# EAGLE design 50Ohm (EAGLE 9.6.2)
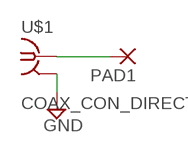
[diagram p0: schematic, sheet 1]

## Parts
PAD1  SMD5  [SMD2,54-5,08]
U$1  COAX_CON_DIRECT  [COAX.141]

## Nets
GND: U$1.P$2(GND)
N$1: PAD1.1(P) U$1.P$1

## Library data of the parts
PAD1 = wirepad:SMD5: SMD PAD
U$1 = Orzada:COAX_CON_DIRECT: Direct Coax to Bord Top

## Board
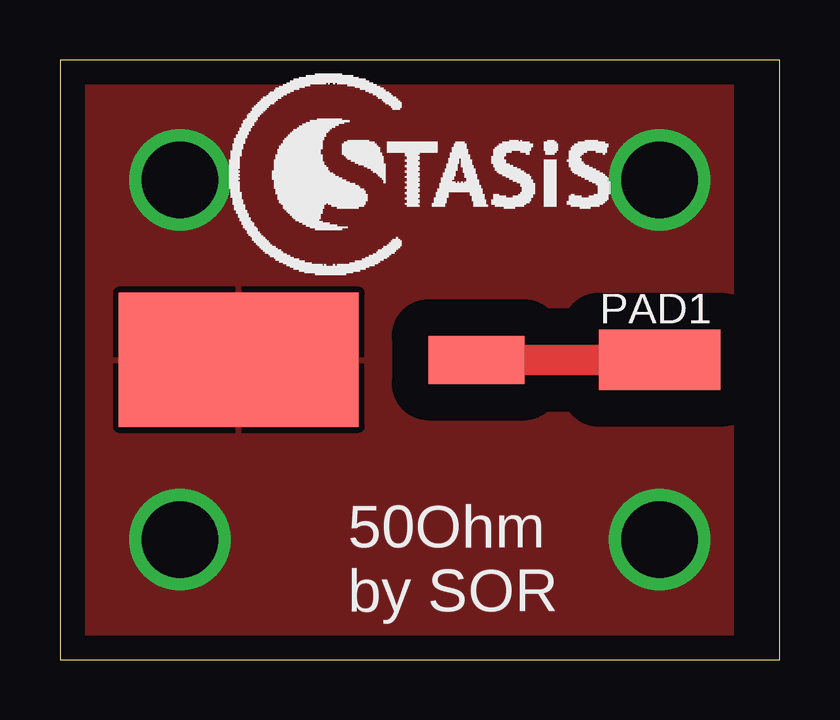
[diagram p1: board, top side]
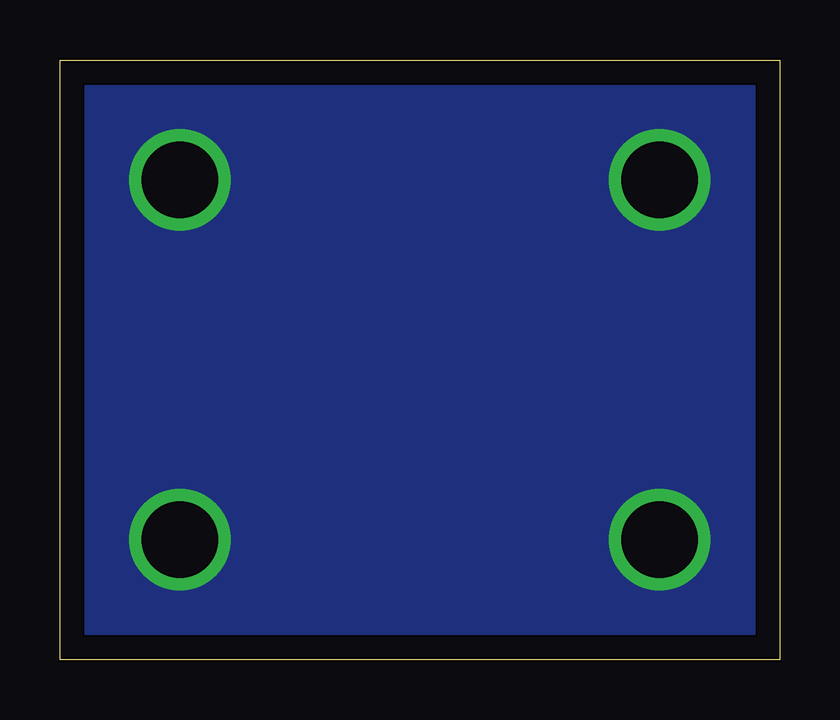
[diagram p2: board, bottom side, seen from below]

Size 30 x 25 mm. Coordinates in mm from the lower left corner, seen from the top.
Outline: 0,0 30,0 30,25 0,25 0,0
Copper layers (1*16): Top 0.035mm / dielectric 1.5mm / Bottom 0.035mm
Design rules "default *": minimum track width 6mil, minimum drill 0.35mm, track to track 60mil, track to pad 60mil, pad to pad 6mil, via to via 6mil, smd to smd 6mil, copper to edge 40mil, drill to drill 6mil, minimum pad ring 10mil, minimum via ring 8mil, stop-mask expansion 4mil, vias tented up to drill 0mil, thermal gap 10mil

### Footprints (pad centres in the part's own frame; a part is rotated, then mirrored left to right if it is on the bottom)
SMD2,54-5,08 = smd 2.54 x 5.08: 1 0,0
COAX.141 = smd 4 x 2: P$1 -3.364,0 | smd 10 x 5.588: P$2 6.546,0

### Placement (x,y rotation side)
PAD1  25,12.5 270 top
U$1  14,12.5 180 top
U$2  [LOGO_STASIS]  16,20 0 top

### Tracks (layer width: path | path; a pad name or v marks a point on that pad's centre or on a via)
GND  (via drill 3.2)
  other vias: 5,20 5,5 25,5 25,20
  pour Top: 1,24 1,1 28,1 28,24
  pour Bottom: 1,24 1,1 29,1 29,24
N$1
  Top 1.27: U$1.P$1 PAD1.1

### Text on the board
tPlace: 50Ohm / by SOR